# EAGLE schematic Schematic_v11 (EAGLE 9.7.0)
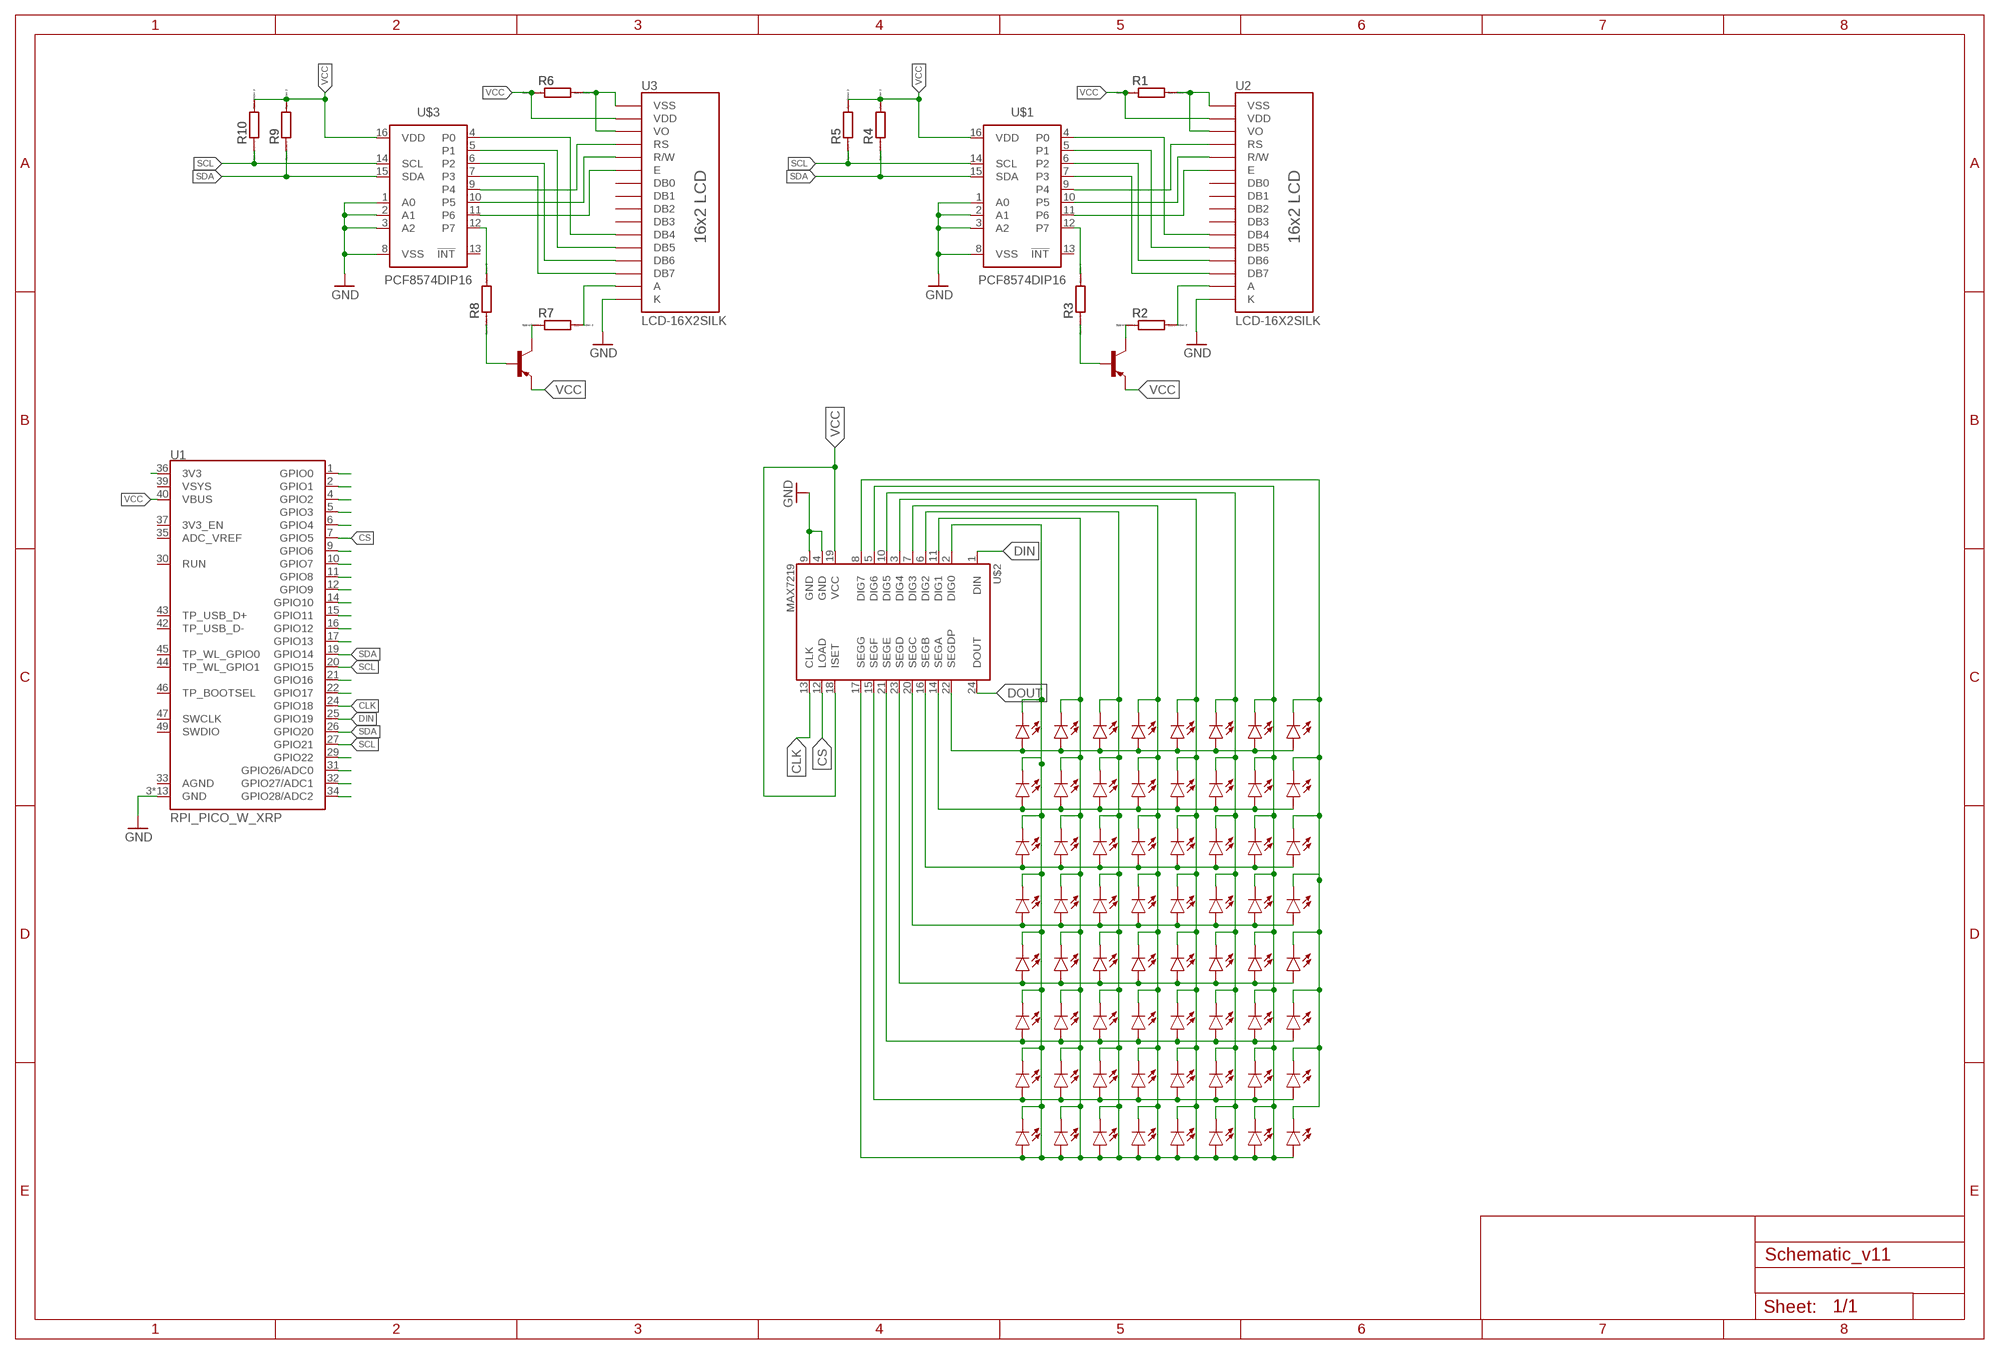
[diagram p0: schematic, sheet 1]

## Parts
D1  CHIP-FLAT-B_0603-0.35MM  [LEDC1608X35N_FLAT-B]
D2  CHIP-FLAT-B_0603-0.35MM  [LEDC1608X35N_FLAT-B]
D3  CHIP-FLAT-B_0603-0.35MM  [LEDC1608X35N_FLAT-B]
D4  CHIP-FLAT-B_0603-0.35MM  [LEDC1608X35N_FLAT-B]
D5  CHIP-FLAT-B_0603-0.35MM  [LEDC1608X35N_FLAT-B]
D6  CHIP-FLAT-B_0603-0.35MM  [LEDC1608X35N_FLAT-B]
D7  CHIP-FLAT-B_0603-0.35MM  [LEDC1608X35N_FLAT-B]
D8  CHIP-FLAT-B_0603-0.35MM  [LEDC1608X35N_FLAT-B]
D9  CHIP-FLAT-B_0603-0.35MM  [LEDC1608X35N_FLAT-B]
D10  CHIP-FLAT-B_0603-0.35MM  [LEDC1608X35N_FLAT-B]
D11  CHIP-FLAT-B_0603-0.35MM  [LEDC1608X35N_FLAT-B]
D12  CHIP-FLAT-B_0603-0.35MM  [LEDC1608X35N_FLAT-B]
D13  CHIP-FLAT-B_0603-0.35MM  [LEDC1608X35N_FLAT-B]
D14  CHIP-FLAT-B_0603-0.35MM  [LEDC1608X35N_FLAT-B]
D15  CHIP-FLAT-B_0603-0.35MM  [LEDC1608X35N_FLAT-B]
D16  CHIP-FLAT-B_0603-0.35MM  [LEDC1608X35N_FLAT-B]
D17  CHIP-FLAT-B_0603-0.35MM  [LEDC1608X35N_FLAT-B]
D18  CHIP-FLAT-B_0603-0.35MM  [LEDC1608X35N_FLAT-B]
D19  CHIP-FLAT-B_0603-0.35MM  [LEDC1608X35N_FLAT-B]
D20  CHIP-FLAT-B_0603-0.35MM  [LEDC1608X35N_FLAT-B]
D21  CHIP-FLAT-B_0603-0.35MM  [LEDC1608X35N_FLAT-B]
D22  CHIP-FLAT-B_0603-0.35MM  [LEDC1608X35N_FLAT-B]
D23  CHIP-FLAT-B_0603-0.35MM  [LEDC1608X35N_FLAT-B]
D24  CHIP-FLAT-B_0603-0.35MM  [LEDC1608X35N_FLAT-B]
D25  CHIP-FLAT-B_0603-0.35MM  [LEDC1608X35N_FLAT-B]
D26  CHIP-FLAT-B_0603-0.35MM  [LEDC1608X35N_FLAT-B]
D27  CHIP-FLAT-B_0603-0.35MM  [LEDC1608X35N_FLAT-B]
D28  CHIP-FLAT-B_0603-0.35MM  [LEDC1608X35N_FLAT-B]
D29  CHIP-FLAT-B_0603-0.35MM  [LEDC1608X35N_FLAT-B]
D30  CHIP-FLAT-B_0603-0.35MM  [LEDC1608X35N_FLAT-B]
D31  CHIP-FLAT-B_0603-0.35MM  [LEDC1608X35N_FLAT-B]
D32  CHIP-FLAT-B_0603-0.35MM  [LEDC1608X35N_FLAT-B]
D33  CHIP-FLAT-B_0603-0.35MM  [LEDC1608X35N_FLAT-B]
D34  CHIP-FLAT-B_0603-0.35MM  [LEDC1608X35N_FLAT-B]
D35  CHIP-FLAT-B_0603-0.35MM  [LEDC1608X35N_FLAT-B]
D36  CHIP-FLAT-B_0603-0.35MM  [LEDC1608X35N_FLAT-B]
D37  CHIP-FLAT-B_0603-0.35MM  [LEDC1608X35N_FLAT-B]
D38  CHIP-FLAT-B_0603-0.35MM  [LEDC1608X35N_FLAT-B]
D39  CHIP-FLAT-B_0603-0.35MM  [LEDC1608X35N_FLAT-B]
D40  CHIP-FLAT-B_0603-0.35MM  [LEDC1608X35N_FLAT-B]
D41  CHIP-FLAT-B_0603-0.35MM  [LEDC1608X35N_FLAT-B]
D42  CHIP-FLAT-B_0603-0.35MM  [LEDC1608X35N_FLAT-B]
D43  CHIP-FLAT-B_0603-0.35MM  [LEDC1608X35N_FLAT-B]
D44  CHIP-FLAT-B_0603-0.35MM  [LEDC1608X35N_FLAT-B]
D45  CHIP-FLAT-B_0603-0.35MM  [LEDC1608X35N_FLAT-B]
D46  CHIP-FLAT-B_0603-0.35MM  [LEDC1608X35N_FLAT-B]
D47  CHIP-FLAT-B_0603-0.35MM  [LEDC1608X35N_FLAT-B]
D48  CHIP-FLAT-B_0603-0.35MM  [LEDC1608X35N_FLAT-B]
D49  CHIP-FLAT-B_0603-0.35MM  [LEDC1608X35N_FLAT-B]
D50  CHIP-FLAT-B_0603-0.35MM  [LEDC1608X35N_FLAT-B]
D51  CHIP-FLAT-B_0603-0.35MM  [LEDC1608X35N_FLAT-B]
D52  CHIP-FLAT-B_0603-0.35MM  [LEDC1608X35N_FLAT-B]
D53  CHIP-FLAT-B_0603-0.35MM  [LEDC1608X35N_FLAT-B]
D54  CHIP-FLAT-B_0603-0.35MM  [LEDC1608X35N_FLAT-B]
D55  CHIP-FLAT-B_0603-0.35MM  [LEDC1608X35N_FLAT-B]
D56  CHIP-FLAT-B_0603-0.35MM  [LEDC1608X35N_FLAT-B]
D57  CHIP-FLAT-B_0603-0.35MM  [LEDC1608X35N_FLAT-B]
D58  CHIP-FLAT-B_0603-0.35MM  [LEDC1608X35N_FLAT-B]
D59  CHIP-FLAT-B_0603-0.35MM  [LEDC1608X35N_FLAT-B]
D60  CHIP-FLAT-B_0603-0.35MM  [LEDC1608X35N_FLAT-B]
D61  CHIP-FLAT-B_0603-0.35MM  [LEDC1608X35N_FLAT-B]
D62  CHIP-FLAT-B_0603-0.35MM  [LEDC1608X35N_FLAT-B]
D63  CHIP-FLAT-B_0603-0.35MM  [LEDC1608X35N_FLAT-B]
D64  CHIP-FLAT-B_0603-0.35MM  [LEDC1608X35N_FLAT-B]
Q1  PNP_BC327*_TO92-CBE  [TO92]
Q2  PNP_BC327*_TO92-CBE  [TO92]
R1  ESP32_WROVER_EAGLE-LTSPICE_RR0402  [ESP32_WROVER_EAGLE-LTSPICE_R0402]
R2  ESP32_WROVER_EAGLE-LTSPICE_RR0402  [ESP32_WROVER_EAGLE-LTSPICE_R0402]
R3  ESP32_WROVER_EAGLE-LTSPICE_RR0402  [ESP32_WROVER_EAGLE-LTSPICE_R0402]
R4  ESP32_WROVER_EAGLE-LTSPICE_RR0402  [ESP32_WROVER_EAGLE-LTSPICE_R0402]
R5  ESP32_WROVER_EAGLE-LTSPICE_RR0402  [ESP32_WROVER_EAGLE-LTSPICE_R0402]
R6  ESP32_WROVER_EAGLE-LTSPICE_RR0402  [ESP32_WROVER_EAGLE-LTSPICE_R0402]
R7  ESP32_WROVER_EAGLE-LTSPICE_RR0402  [ESP32_WROVER_EAGLE-LTSPICE_R0402]
R8  ESP32_WROVER_EAGLE-LTSPICE_RR0402  [ESP32_WROVER_EAGLE-LTSPICE_R0402]
R9  ESP32_WROVER_EAGLE-LTSPICE_RR0402  [ESP32_WROVER_EAGLE-LTSPICE_R0402]
R10  ESP32_WROVER_EAGLE-LTSPICE_RR0402  [ESP32_WROVER_EAGLE-LTSPICE_R0402]
U1  RPI_PICO_W_XRP  [RPI_PICO_W]
U2  LCD-16X2SILK  [MODULE_LCD-16X2]
U3  LCD-16X2SILK  [MODULE_LCD-16X2]
U$1  PCF8574DIP16  [DIL16]
U$2  MAX7219-DIP  [DIL24]
U$3  PCF8574DIP16  [DIL16]

## Nets
3V3: U1.36(3V3)
CLK: U1.24(GPIO18) U$2.13(CLK)
CS: U1.7(GPIO5) U$2.12(LOAD)
D+: U1.1(GPIO0)
D-: U1.2(GPIO1)
DIN: U1.25(GPIO19) U$2.1(DIN)
DOUT: U$2.24(DOUT)
GND: U1.3(GND) U1.8(GND) U1.13(GND) U1.18(GND) U1.23(GND) U1.28(GND) U1.38(GND) U1.41(GND) U1.48(GND) U1.A(GND) U1.B(GND) U1.C(GND) U1.D(GND) U2.16(K) U3.16(K) U$1.1(A0) U$1.2(A1) U$1.3(A2) U$1.8(VSS) U$2.4(GND) U$2.9(GND) U$3.1(A0) U$3.2(A1) U$3.3(A2) U$3.8(VSS)
N$1: D1.A D2.A D3.A D4.A D5.A D6.A D7.A D8.A U$2.22(SEGDP)
N$2: R1.2 U2.1(VSS) U2.3(VO)
N$3: R6.2 U3.1(VSS) U3.3(VO)
N$4: U2.6(E) U$1.11(P6)
N$5: U2.5(R/W) U$1.10(P5)
N$6: U2.4(RS) U$1.9(P4)
N$7: U2.11(DB4) U$1.4(P0)
N$8: U2.12(DB5) U$1.5(P1)
N$9: D1.C D2.C D3.C D4.C D5.C D6.C D7.C D9.C D10.C D11.C D12.C D13.C D14.C D15.C D17.C D18.C D19.C D20.C D21.C D22.C D23.C D25.C D26.C D27.C D28.C D29.C D30.C D31.C D33.C D34.C D35.C D36.C D37.C D38.C D39.C D41.C D42.C D43.C D44.C D45.C D46.C D47.C D49.C D50.C D51.C D52.C D53.C D54.C D55.C D57.A D57.C D58.A D58.C D59.A D59.C D60.A D60.C D61.A D61.C D62.A D62.C D63.A D63.C D64.A U$2.2(DIG0) U$2.3(DIG4) U$2.5(DIG6) U$2.6(DIG2) U$2.7(DIG3) U$2.10(DIG5) U$2.11(DIG1) U$2.17(SEGG)
N$10: D9.A D10.A D11.A D12.A D13.A D14.A D15.A D16.A U$2.14(SEGA)
N$11: U2.13(DB6) U$1.6(P2)
N$12: U2.14(DB7) U$1.7(P3)
N$13: Q1.1(C) R2.1
N$14: U3.6(E) U$3.11(P6)
N$15: R3.2 U$1.12(P7)
N$16: U3.5(R/W) U$3.10(P5)
N$17: U3.4(RS) U$3.9(P4)
N$18: U3.11(DB4) U$3.4(P0)
N$19: D17.A D18.A D19.A D20.A D21.A D22.A D23.A D24.A U$2.16(SEGB)
N$20: U3.12(DB5) U$3.5(P1)
N$21: U1.4(GPIO2)
N$22: U1.5(GPIO3)
N$23: U1.6(GPIO4)
N$24: U3.13(DB6) U$3.6(P2)
N$25: U1.9(GPIO6)
N$26: U1.10(GPIO7)
N$27: U3.14(DB7) U$3.7(P3)
N$28: D25.A D26.A D27.A D28.A D29.A D30.A D31.A D32.A U$2.20(SEGC)
N$29: U1.11(GPIO8)
N$30: U1.12(GPIO9)
N$31: U1.14(GPIO10)
N$32: U1.15(GPIO11)
N$33: U1.16(GPIO12)
N$34: U1.17(GPIO13)
N$35: U1.19(GPIO14)
N$36: U1.20(GPIO15)
N$37: D33.A D34.A D35.A D36.A D37.A D38.A D39.A D40.A U$2.23(SEGD)
N$38: U1.21(GPIO16)
N$39: U1.22(GPIO17)
N$40: R8.2 U$3.12(P7)
N$41: Q2.1(C) R7.1
N$42: Q1.2(B) R3.1
N$43: Q2.2(B) R8.1
N$44: U1.29(GPIO22)
N$45: U1.31(GPIO26/ADC0)
N$46: D41.A D42.A D43.A D44.A D45.A D46.A D47.A D48.A U$2.21(SEGE)
N$47: U1.32(GPIO27/ADC1)
N$48: U1.34(GPIO28/ADC2)
N$55: D49.A D50.A D51.A D52.A D53.A D54.A D55.A D56.A U$2.15(SEGF)
N$69: D8.C D16.C D24.C D32.C D40.C D48.C D56.C D64.C U$2.8(DIG7)
SCL: R5.1 R10.1 U1.27(GPIO21) U$1.14(SCL) U$3.14(SCL)
SDA: R4.1 R9.1 U1.26(GPIO20) U$1.15(SDA) U$3.15(SDA)
VCC: Q1.3(E) Q2.3(E) R1.1 R2.2 R4.2 R5.2 R6.1 R7.2 R9.2 R10.2 U1.40(VBUS) U2.2(VDD) U2.15(A) U3.2(VDD) U3.15(A) U$1.16(VDD) U$2.18(ISET) U$2.19(VCC) U$3.16(VDD)
Unconnected: U1.30(RUN) U1.33(AGND) U1.35(ADC_VREF) U1.37(3V3_EN) U1.39(VSYS) U1.42(TP_USB_D-) U1.43(TP_USB_D+) U1.44(TP_WL_GPIO1) U1.45(TP_WL_GPIO0) U1.46(TP_BOOTSEL) U1.47(SWCLK) U1.49(SWDIO) U2.7(DB0) U2.8(DB1) U2.9(DB2) U2.10(DB3) U3.7(DB0) U3.8(DB1) U3.9(DB2) U3.10(DB3) U$1.13(!INT) U$3.13(!INT)

## Library data of the parts
D1-D64 = LED:CHIP-FLAT-B: Blue LED - Generic; CATEGORY: LED; COLOR: Blue; DESCRIPTION: Blue LED Indication 0603 (1608 Metric); PACKAGE_SIZE: 0603; PACKAGE_TYPE: SMD; SUBCATEGORY: Chip LED; TYPE: Square with Flat Top
Q1 Q2 = Transistor:PNP_: PNP Transistor - Popular parts; CATEGORY: Transistor; DATASHEET: https://www.onsemi.com/products/discrete-power-modules/general-purpose-and-low-vcesat-transistors/BC327; DESCRIPTION: Bipolar (BJT) Transistor PNP 45 V 800 mA 100MHz 625 mW Through Hole TO-92-3; DRAIN_CURRENT: NA; IC_MAX: 800 mA; MANUFACTURER: onsemi; MPN: BC327A; OPERATING_TEMPERATURE: -65°C ~ 150°C; PACKAGE_SIZE: TO-92; PACKAGE_TYPE: THT; PART_STATUS: OBSOLETE; ROHS: COMPLIANT; SERIES: BC327; SUBCATEGORY: BJT; THERMALLOSS: 0.625 W; TYPE: PNP; VCEO_MAX: 45 V
R1-R10 = DeskAssistant_v19_v1:ESP32_WROVER_EAGLE-LTSPICE_R: RESISTOR, European symbol; SPICEMODEL: NONE; SPICEPREFIX: R
U1 = SparkFun-IC-Microcontroller:RPI_PICO_W; PROD_ID: COMP-18042
U2 U3 = LCD-16X2:LCD-16X2: Check availability <https://pricing.snapeda.com/parts/LCD-16X2/Gravitech/view-part?ref=eda>; AVAILABILITY: Not in stock; CHECK_PRICES: https://www.snapeda.com/parts/LCD-16X2/Gravitech/view-part/?ref=eda; DESCRIPTION: Display Development Tools 16x2 Black on Green Char LCD w Backlight; MF: Gravitech; MP: LCD-16X2; PACKAGE: None; PRICE: None; SNAPEDA_LINK: https://www.snapeda.com/parts/LCD-16X2/Gravitech/view-part/?ref=snap
U$1 U$3 = Tinkercad:PCF8574
U$2 = MAX7219:MAX7219: Check availability <https://pricing.snapeda.com/parts/MAX7219/Analog%20Devices/view-part?ref=eda>; AVAILABILITY: In Stock; CHECK_PRICES: https://www.snapeda.com/parts/MAX7219/Analog+Devices/view-part/?ref=eda; DESCRIPTION: IC DRVR 7 SEGMENT 8 DIGIT 24DIP; MF: Analog Devices; MP: MAX7219; PACKAGE: None; PRICE: None; SNAPEDA_LINK: https://www.snapeda.com/parts/MAX7219/Analog+Devices/view-part/?ref=snap

## Net classes
1 power: width 0.178 mm